# EAGLE design ax5243_feather (EAGLE 8.2.2)
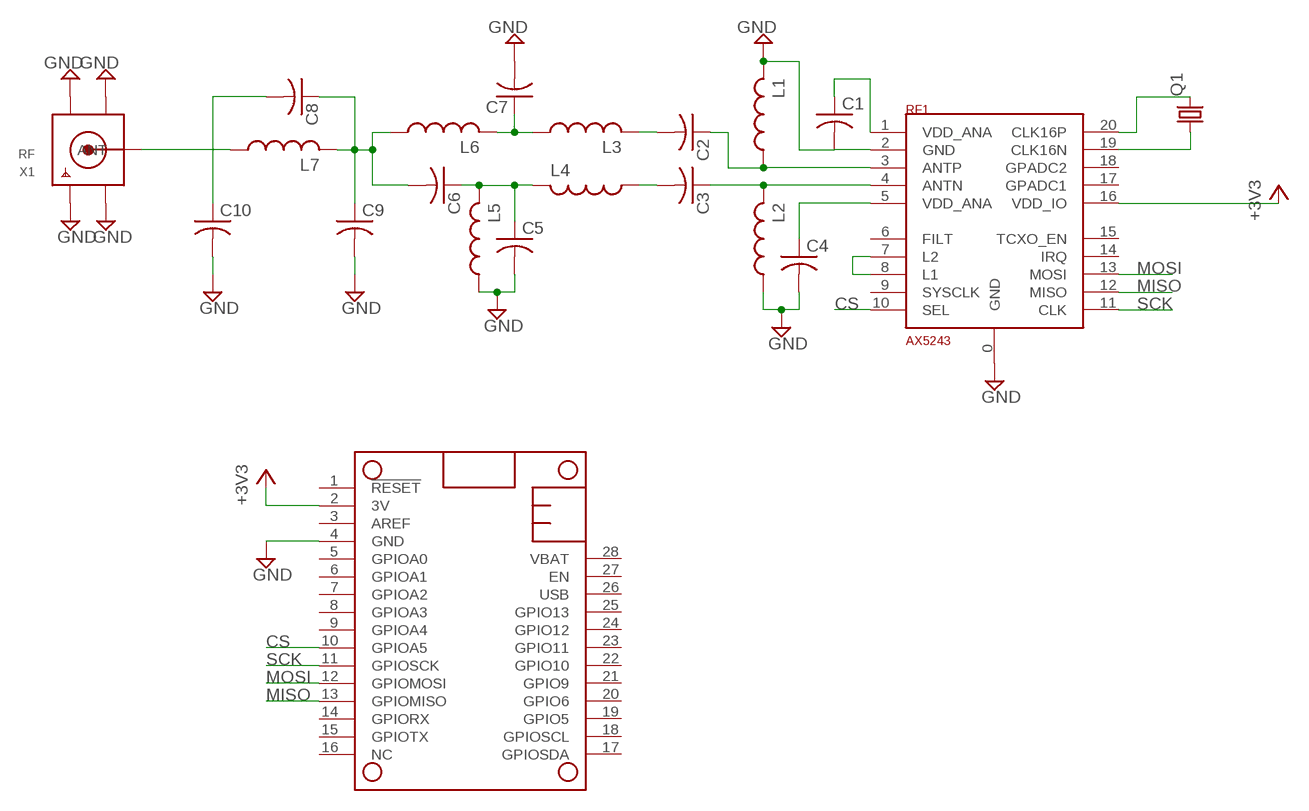
[diagram p0: schematic, sheet 1]

## Parts
C1  C-USC0805K  [C0805K]
C2  C-USC0805K  [C0805K]
C3  C-USC0805K  [C0805K]
C4  C-USC0805K  [C0805K]
C5  C-USC0805K  [C0805K]
C6  C-USC0805K  [C0805K]
C7  C-USC0805K  [C0805K]
C8  C-USC0805K  [C0805K]
C9  C-USC0805K  [C0805K]
C10  C-USC0805K  [C0805K]
L1  L-US0805K  [C0805K]
L2  L-US0805K  [C0805K]
L3  L-US0805K  [C0805K]
L4  L-US0805K  [C0805K]
L5  L-US0805K  [C0805K]
L6  L-US0805K  [C0805K]
L7  L-US0805K  [C0805K]
MS1  FEATHERWING  [FEATHERWING]
Q1  CRYSTALCTS406  [CTS406]
RF1  AX5243  [QFN20-4X4MM]
X1  RF  SMACONNECTOR_EDGE_UFL  [SMA_EDGELAUNCH_UFL]

## Nets
+3V3: MS1.2(3V) RF1.16(VDD_IO)
ANTN: C3.1 L2.2 RF1.4(ANTN)
ANTP: C2.1 L1.1 RF1.3(ANTP)
CS: MS1.10(GPIOA5) RF1.10(SEL)
GND: C1.2 C4.2 C5.2 C7.2 C9.2 C10.2 L1.2 L2.1 L5.1 MS1.4(GND) RF1.0(GND) RF1.2(GND) X1.GND@1(GND1) X1.GND@2(GND2) X1.GND@3(GND3) X1.GND@4(GND4)
MISO: MS1.13(GPIOMISO) RF1.12(MISO)
MOSI: MS1.12(GPIOMOSI) RF1.13(MOSI)
N$1: RF1.7(L2) RF1.8(L1)
N$2: C4.1 RF1.5(VDD_ANA)
N$3: C1.1 RF1.1(VDD_ANA)
N$4: Q1.3 RF1.20(CLK16P)
N$5: C3.2 L4.1
N$6: C2.2 L3.2
N$7: C5.1 C6.1 L4.2 L5.2
N$8: Q1.1 RF1.19(CLK16N)
N$9: C6.2 C8.1 C9.1 L6.1 L7.2
N$10: C7.1 L3.1 L6.2
N$11: C8.2 C10.1 L7.1 X1.P(ANT)
SCK: MS1.11(GPIOSCK) RF1.11(CLK)
Unconnected: MS1.1(!RESET) MS1.3(AREF) MS1.5(GPIOA0) MS1.6(GPIOA1) MS1.7(GPIOA2) MS1.8(GPIOA3) MS1.9(GPIOA4) MS1.14(GPIORX) MS1.15(GPIOTX) MS1.16(NC) MS1.17(GPIOSDA) MS1.18(GPIOSCL) MS1.19(GPIO5) MS1.20(GPIO6) MS1.21(GPIO9) MS1.22(GPIO10) MS1.23(GPIO11) MS1.24(GPIO12) MS1.25(GPIO13) MS1.26(USB) MS1.27(EN) MS1.28(VBAT) RF1.6(FILT) RF1.9(SYSCLK) RF1.14(IRQ) RF1.15(TCXO_EN) RF1.17(GPADC1) RF1.18(GPADC2)

## Library data of the parts
C1-C10 = rcl:C-US: CAPACITOR, American symbol
L1-L7 = kj4qlp:L-US0805K
MS1 = adafruit:FEATHERWING
Q1 = adafruit:CRYSTAL: CRYSTAL; OC_FARNELL: unknown; OC_NEWARK: unknown
RF1 = kj4qlp:AX5243
X1 = adafruit:SMACONNECTOR: SMA Connector 90° DIP SMA Connector, 50 Ohm (4UConnector: 07259)

## Board
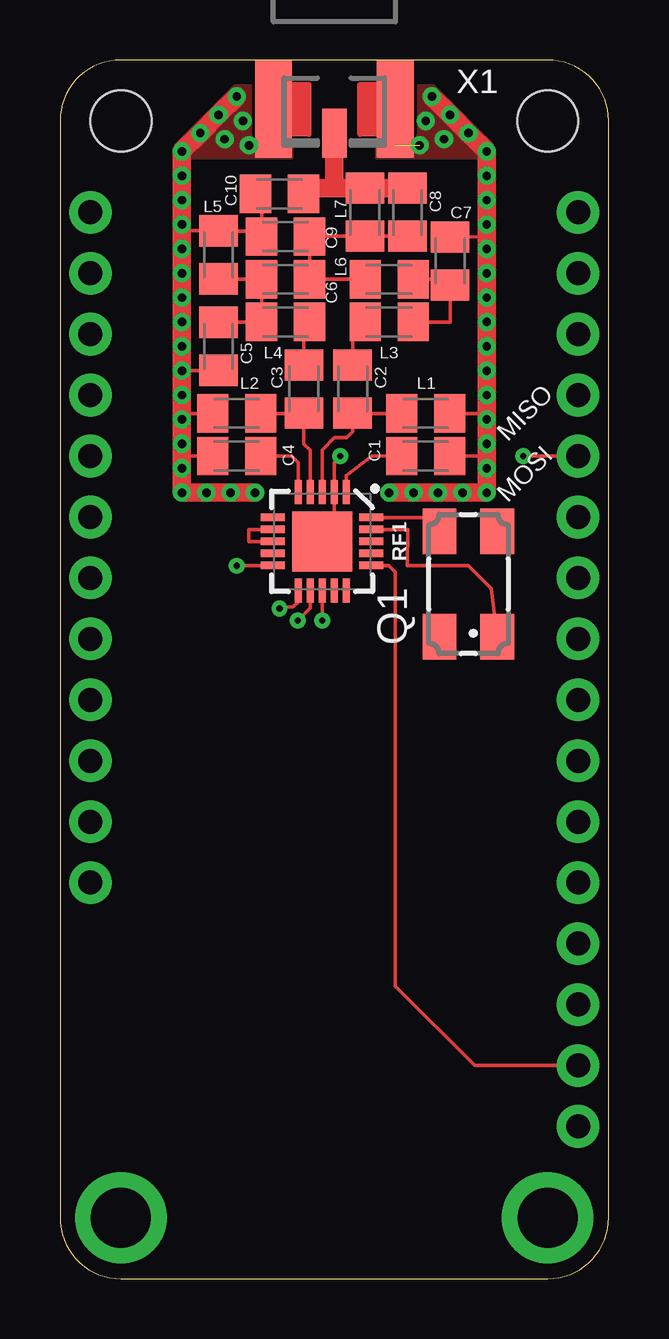
[diagram p1: board, top side]
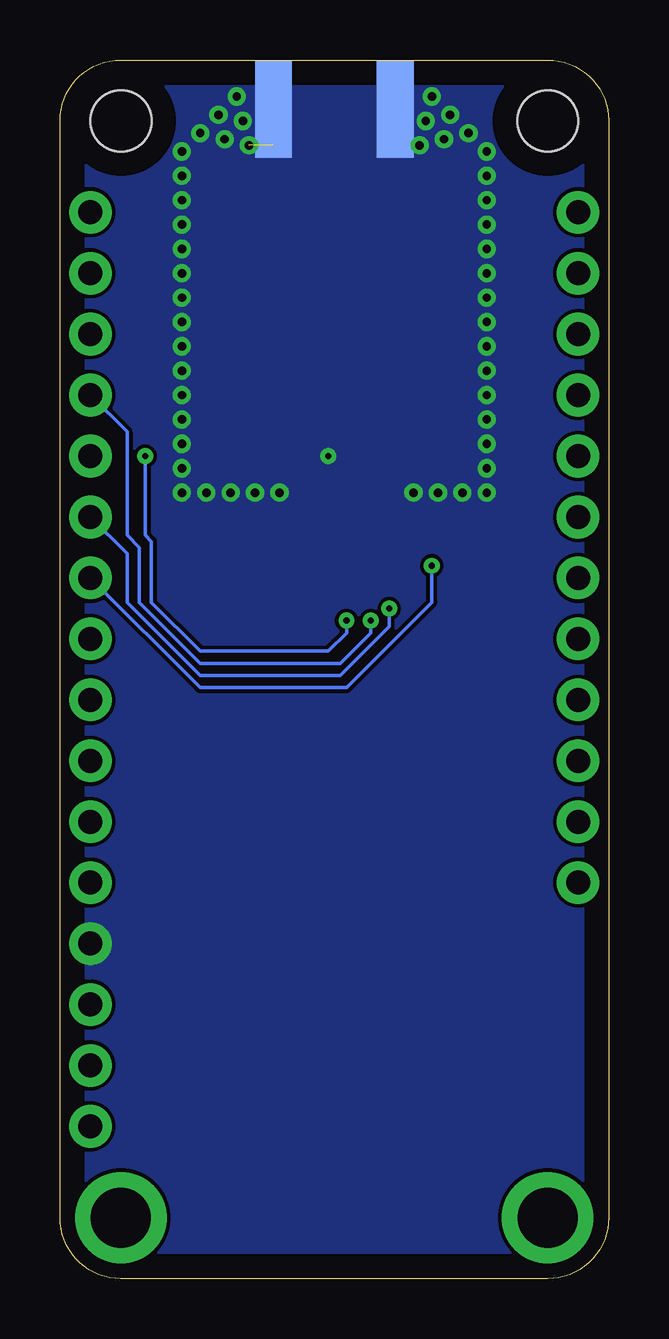
[diagram p2: board, bottom side, seen from below]

Size 22.86 x 50.8 mm. Coordinates in mm from the lower left corner, seen from the top.
Copper layers (1*16): Top 0.035mm / dielectric 1.5mm / Bottom 0.035mm
Design rules "default": minimum track width 6mil, minimum drill 0.35mm, track to track 6mil, track to pad 6mil, pad to pad 6mil, via to via 6mil, smd to smd 6mil, copper to edge 40mil, drill to drill 6mil, minimum pad ring 10mil, minimum via ring 8mil, stop-mask expansion 4mil, vias tented up to drill 0mil, thermal gap 10mil

### Footprints (pad centres in the part's own frame; a part is rotated, then mirrored left to right if it is on the bottom)
C0805K = smd 1.3 x 1.6: 1 -1,0; 2 1,0
FEATHERWING = drill 1 pad 1.778: 1 6.35,1.27; 2 8.89,1.27; 3 11.43,1.27; 4 13.97,1.27; 5 16.51,1.27; 6 19.05,1.27; 7 21.59,1.27; 8 24.13,1.27; 9 26.67,1.27; 10 29.21,1.27; 11 31.75,1.27; 12 34.29,1.27; 13 36.83,1.27; 14 39.37,1.27; 15 41.91,1.27; 16 44.45,1.27; 17 44.45,21.59; 18 41.91,21.59; 19 39.37,21.59; 20 36.83,21.59; 21 34.29,21.59; 22 31.75,21.59; 23 29.21,21.59; 24 26.67,21.59; 25 24.13,21.59; 26 21.59,21.59; 27 19.05,21.59; 28 16.51,21.59 | drill 2.5 pad 3.81: P$1 2.54,20.32; P$2 2.54,2.54 | hole 2.54: 48.26,20.32; 48.26,2.54
CTS406 = smd 1.9 x 1.4: 1 -2.2,-1.2; 2 2.2,-1.2; 3 2.2,1.2; 4 -2.2,1.2
QFN20-4X4MM = smd 2.5 x 2.5: 0 0,0 | smd 1 x 0.3: 1 -2.055,1; 2 -2.055,0.5; 3 -2.055,0; 4 -2.055,-0.5; 5 -2.055,-1; 11 2.055,-1; 12 2.055,-0.5; 13 2.055,0; 14 2.055,0.5; 15 2.055,1 | smd 0.3 x 1: 6 -1,-2.055; 7 -0.5,-2.055; 8 0,-2.055; 9 0.5,-2.055; 10 1,-2.055; 16 1,2.055; 17 0.5,2.055; 18 0,2.055; 19 -0.5,2.055; 20 -1,2.055
SMA_EDGELAUNCH_UFL = smd 4.064 x 1.524: GND@1 2.032,-2.54; GND@2 2.032,2.54 | smd 4.064 x 1.524 bottom: GND@3 2.032,2.54; GND@4 2.032,-2.54 | smd 2.032 x 1.016: P 3.048,0

### Placement (x,y rotation side)
C1  15.24,34.29 0 top
C2  12.19,37.08 90 top
C3  10.16,37.08 90 top
C4  7.37,34.29 180 top
C5  6.6,38.86 270 top
C6  9.4,41.66 0 top
C7  16.26,42.42 90 top
C8  14.48,44.45 90 top
C9  9.4,43.43 180 top
C10  9.14,45.21 180 top
L1  15.24,36.07 0 top
L2  7.37,36.07 0 top
L3  13.72,39.88 180 top
L4  9.4,39.88 180 top
L5  6.6,42.67 270 top
L6  13.72,41.66 0 top
L7  12.7,44.45 270 top
MS1  22.86,0 90 top
Q1  17.02,28.96 90 top
RF1  10.92,30.73 270 top
X1  11.43,50.8 270 top

### Tracks (layer width: path | path; a pad name or v marks a point on that pad's centre or on a via)
+3V3
  Top 0.152: MS1.2 17.27,8.89 13.97,12.19 13.97,29.46 13.7,29.73 RF1.16
ANTN
  Top 0.152: L2.2 9.41,36.07 C3.1 10.16,34.8 10.42,34.54 RF1.4
ANTP
  Top 0.152: RF1.3 10.92,34.54 11.43,35.05 11.94,35.05 12.19,35.31 12.19,36.07 | 12.19,36.07 C2.1 | L1.1 12.19,36.07
CS  (via drill 0.25)
  Top 0.152: RF1.10 7.38,29.73 v7.37,29.72
  Bottom 0.152: MS1.10 17.02,24.64 10.92,24.64 7.37,28.19 v7.37,29.72
GND  (via drill 0.25, 0.35)  (1 unrouted)
  Top 0.152: v11.68,34.29 11.42,34.03 RF1.2 11.42,31.23 RF1.0 | L1.2 17.78,36.07 | C7.2 17.78,43.43 17.69,43.43 | C1.2 17.78,34.29 | X1.GND@4 8.89,49.28 | X1.GND@4 8.89,48.26 | X1.GND@4 8.89,47.24 | 13.97,47.24 X1.GND@3 13.97,49.28 | C5.2 5.11,37.86 5.08,37.81 | 5.08,43.68 4.81,43.69 5.84,43.69 L5.1 8.4,43.67 | 5.08,36.05 5.33,36.07 L2.1 | 5.08,34.3 5.58,34.29 C4.2 | C10.2 8.4,45.21 8.4,43.67 | 8.4,43.67 C9.2
  Top 0.762: v15.49,49.28 v16.26,48.51 v17.02,47.75 v17.78,46.99 v17.78,45.97 v17.78,44.96 v17.78,43.94 17.78,43.43 v17.78,42.93 v17.78,41.91 v17.78,40.89 v17.78,39.88 v17.78,38.86 v17.78,37.85 v17.78,36.83 17.78,36.07 v17.78,35.81 v17.78,34.8 17.78,34.29 v17.78,33.78 v17.78,32.77 v16.76,32.77 v15.75,32.77 v14.73,32.77 v13.72,32.77 | v8.13,32.77 v7.11,32.77 v6.1,32.77 v5.08,32.77 v5.08,33.78 5.08,34.3 v5.08,34.8 v5.08,35.81 5.08,36.05 v5.08,36.83 5.08,37.81 v5.08,37.85 v5.08,38.86 v5.08,39.88 v5.08,40.89 v5.08,41.91 v5.08,42.93 5.08,43.68 v5.08,43.94 v5.08,44.96 v5.08,45.97 v5.08,46.99 v5.84,47.75 v6.6,48.51 v7.37,49.28
  other vias: 7.62,48.26 6.86,47.5 15.24,48.26 16,47.5 7.87,47.24 14.99,47.24
  pour Bottom (no thermals): 2.54,0 0,2.54 0,48.26 2.54,50.8 20.32,50.8 22.86,48.26 22.86,2.54 20.32,0
  pour Top (no thermals): 13.21,49.78 13.21,46.74 17.53,46.74 18.03,47.24 15.49,49.78
  pour Top (no thermals): 9.65,49.78 9.65,46.74 5.33,46.74 4.83,47.24 7.37,49.78
MISO  (via drill 0.25)
  Top 0.152: RF1.12 10.42,27.95 v9.91,27.43
  Bottom 0.152: MS1.13 20.07,35.31 20.07,30.99 19.56,30.48 19.56,28.19 17.02,25.65 11.18,25.65 9.91,26.92 v9.91,27.43
MOSI  (via drill 0.25)
  Top 0.152: MS1.12 v19.3,34.29 | RF1.13 v10.92,27.43
  Bottom 0.152: v19.3,34.29 19.3,30.99 19.05,30.73 19.05,28.19 17.02,26.16 11.68,26.16 10.92,26.92 v10.92,27.43
N$1
  Top 0.152: RF1.8 7.87,30.73 7.87,31.23 RF1.7
N$2
  Top 0.152: RF1.5 9.92,34.02 9.65,34.29 C4.1
N$3
  Top 0.152: RF1.1 11.92,33.48 12.98,34.29 C1.1
N$4
  Top 0.152: RF1.20 15.22,31.73 15.75,31.75 15.73,31.24 Q1.3
N$5
  Top 0.152: C3.2 10.16,39.86 L4.1
N$6
  Top 0.152: L3.2 12.21,39.88 C2.2
N$7
  Top 0.152: L5.2 6.6,41.66 C6.1 L4.2 6.6,39.88 C5.1
N$8
  Top 0.152: RF1.19 14.49,31.23 14.48,29.72 17.02,29.72 17.96,28.77 Q1.1
N$9
  Top 0.152: C8.1 L7.2 10.4,43.45 C9.1 C6.2 L6.1
N$10
  Top 0.152: L6.2 15.48,41.66 C7.1 16.26,39.88 L3.1
N$11
  Top 0.762: C8.2 L7.1 11.43,45.45 | 11.43,45.45 10.14,45.45 C10.1 | 11.43,45.45 X1.P
SCK  (via drill 0.25)
  Top 0.152: RF1.11 9.91,28.19 9.7,27.99 9.2,27.99 v9.14,27.94
  Bottom 0.152: MS1.11 20.07,30.23 20.07,28.19 17.02,25.15 11.18,25.15 9.14,27.18 v9.14,27.94

### Text on the board
tNames: MISO | MOSI